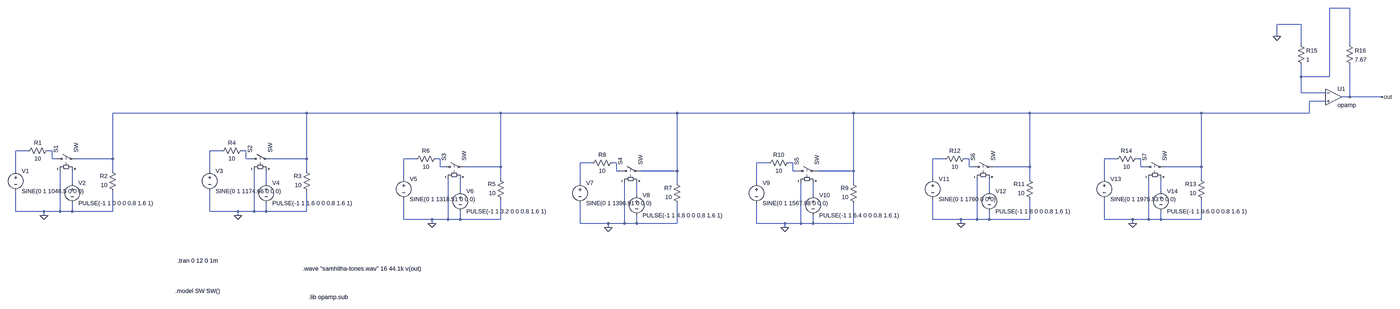
[diagram p0: schematic tones.asc, whole sheet]
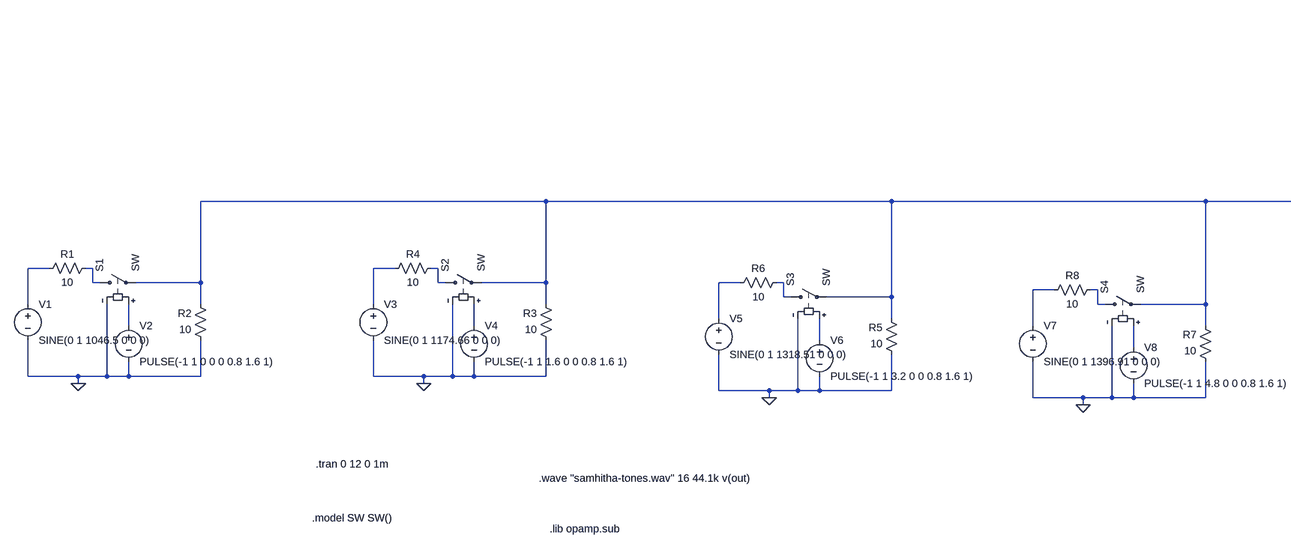
[diagram p1: schematic tones.asc, part, row 1 of 1, column 1 of 2]
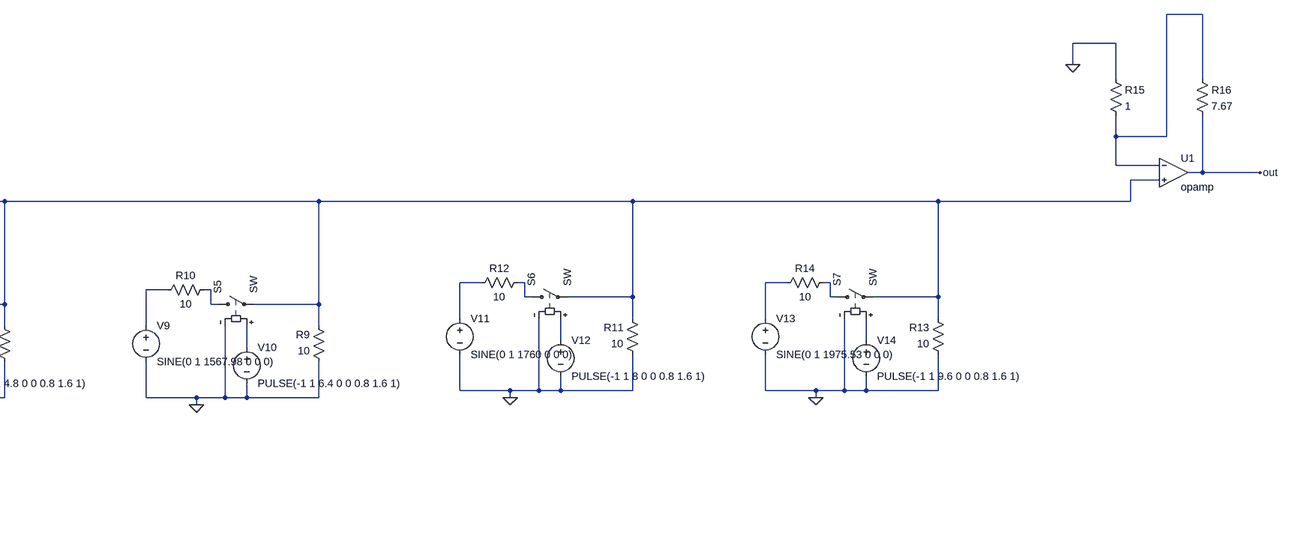
[diagram p2: schematic tones.asc, part, row 1 of 1, column 2 of 2]
tones.asc, the LTspice schematic file:
Version 4
SHEET 1 4744 1940
WIRE 4528 -1920 4448 -1920
WIRE 4336 -1856 4240 -1856
WIRE 4240 -1808 4240 -1856
WIRE 4336 -1776 4336 -1856
WIRE 4528 -1776 4528 -1920
WIRE 4336 -1648 4336 -1696
WIRE 4448 -1648 4448 -1920
WIRE 4448 -1648 4336 -1648
WIRE 4336 -1584 4336 -1648
WIRE 4432 -1584 4336 -1584
WIRE 4528 -1568 4528 -1696
WIRE 4528 -1568 4496 -1568
WIRE 4656 -1568 4528 -1568
WIRE 4432 -1552 4368 -1552
WIRE 96 -1504 -672 -1504
WIRE 864 -1504 96 -1504
WIRE 1632 -1504 864 -1504
WIRE 2384 -1504 1632 -1504
WIRE 3168 -1504 2384 -1504
WIRE 3904 -1504 3168 -1504
WIRE 4368 -1504 4368 -1552
WIRE 4368 -1504 3904 -1504
WIRE -1008 -1232 -1056 -1232
WIRE -912 -1232 -928 -1232
WIRE -240 -1232 -288 -1232
WIRE -144 -1232 -160 -1232
WIRE -912 -1200 -912 -1232
WIRE -896 -1200 -912 -1200
WIRE -672 -1200 -672 -1504
WIRE -672 -1200 -816 -1200
WIRE -144 -1200 -144 -1232
WIRE -128 -1200 -144 -1200
WIRE 96 -1200 96 -1504
WIRE 96 -1200 -48 -1200
WIRE 528 -1200 480 -1200
WIRE 624 -1200 608 -1200
WIRE 2832 -1200 2784 -1200
WIRE 2928 -1200 2912 -1200
WIRE 3568 -1200 3520 -1200
WIRE 3664 -1200 3648 -1200
WIRE 1296 -1184 1248 -1184
WIRE 1392 -1184 1376 -1184
WIRE 2048 -1184 2000 -1184
WIRE 2144 -1184 2128 -1184
WIRE 624 -1168 624 -1200
WIRE 640 -1168 624 -1168
WIRE 864 -1168 864 -1504
WIRE 864 -1168 720 -1168
WIRE 2928 -1168 2928 -1200
WIRE 2944 -1168 2928 -1168
WIRE 3168 -1168 3168 -1504
WIRE 3168 -1168 3024 -1168
WIRE 3664 -1168 3664 -1200
WIRE 3680 -1168 3664 -1168
WIRE 3904 -1168 3904 -1504
WIRE 3904 -1168 3760 -1168
WIRE -1056 -1152 -1056 -1232
WIRE -672 -1152 -672 -1200
WIRE -288 -1152 -288 -1232
WIRE 96 -1152 96 -1200
WIRE 1392 -1152 1392 -1184
WIRE 1408 -1152 1392 -1152
WIRE 1632 -1152 1632 -1504
WIRE 1632 -1152 1488 -1152
WIRE 2144 -1152 2144 -1184
WIRE 2160 -1152 2144 -1152
WIRE 2384 -1152 2384 -1504
WIRE 2384 -1152 2240 -1152
WIRE 480 -1120 480 -1200
WIRE 864 -1120 864 -1168
WIRE 2784 -1120 2784 -1200
WIRE 3168 -1120 3168 -1168
WIRE 3520 -1120 3520 -1200
WIRE 3904 -1120 3904 -1168
WIRE -832 -1104 -832 -1152
WIRE -64 -1104 -64 -1152
WIRE 1248 -1104 1248 -1184
WIRE 1632 -1104 1632 -1152
WIRE 2000 -1104 2000 -1184
WIRE 2384 -1104 2384 -1152
WIRE 704 -1072 704 -1120
WIRE 3008 -1072 3008 -1120
WIRE 3744 -1072 3744 -1120
WIRE 1472 -1056 1472 -1104
WIRE 2224 -1056 2224 -1104
WIRE -1056 -992 -1056 -1072
WIRE -944 -992 -1056 -992
WIRE -880 -992 -880 -1152
WIRE -880 -992 -944 -992
WIRE -832 -992 -832 -1024
WIRE -832 -992 -880 -992
WIRE -672 -992 -672 -1072
WIRE -672 -992 -832 -992
WIRE -288 -992 -288 -1072
WIRE -176 -992 -288 -992
WIRE -112 -992 -112 -1152
WIRE -112 -992 -176 -992
WIRE -64 -992 -64 -1024
WIRE -64 -992 -112 -992
WIRE 96 -992 96 -1072
WIRE 96 -992 -64 -992
WIRE -944 -976 -944 -992
WIRE -176 -976 -176 -992
WIRE 480 -960 480 -1040
WIRE 592 -960 480 -960
WIRE 656 -960 656 -1120
WIRE 656 -960 592 -960
WIRE 704 -960 704 -992
WIRE 704 -960 656 -960
WIRE 864 -960 864 -1040
WIRE 864 -960 704 -960
WIRE 2784 -960 2784 -1040
WIRE 2896 -960 2784 -960
WIRE 2960 -960 2960 -1120
WIRE 2960 -960 2896 -960
WIRE 3008 -960 3008 -992
WIRE 3008 -960 2960 -960
WIRE 3168 -960 3168 -1040
WIRE 3168 -960 3008 -960
WIRE 3520 -960 3520 -1040
WIRE 3632 -960 3520 -960
WIRE 3696 -960 3696 -1120
WIRE 3696 -960 3632 -960
WIRE 3744 -960 3744 -992
WIRE 3744 -960 3696 -960
WIRE 3904 -960 3904 -1040
WIRE 3904 -960 3744 -960
WIRE 592 -944 592 -960
WIRE 1248 -944 1248 -1024
WIRE 1360 -944 1248 -944
WIRE 1424 -944 1424 -1104
WIRE 1424 -944 1360 -944
WIRE 1472 -944 1472 -976
WIRE 1472 -944 1424 -944
WIRE 1632 -944 1632 -1024
WIRE 1632 -944 1472 -944
WIRE 2000 -944 2000 -1024
WIRE 2112 -944 2000 -944
WIRE 2176 -944 2176 -1104
WIRE 2176 -944 2112 -944
WIRE 2224 -944 2224 -976
WIRE 2224 -944 2176 -944
WIRE 2384 -944 2384 -1024
WIRE 2384 -944 2224 -944
WIRE 2896 -944 2896 -960
WIRE 3632 -944 3632 -960
WIRE 1360 -928 1360 -944
WIRE 2112 -928 2112 -944
FLAG -944 -976 0
FLAG -176 -976 0
FLAG 592 -944 0
FLAG 1360 -928 0
FLAG 2112 -928 0
FLAG 2896 -944 0
FLAG 3632 -944 0
FLAG 4240 -1808 0
FLAG 4656 -1568 out
SYMBOL voltage -1056 -1168 R0
WINDOW 123 0 0 Left 0
WINDOW 39 0 0 Left 0
SYMATTR InstName V1
SYMATTR Value SINE(0 1 1046.5 0 0 0)
SYMBOL sw -912 -1200 R270
SYMATTR InstName S1
SYMBOL voltage -832 -1120 R0
WINDOW 123 0 0 Left 0
WINDOW 39 0 0 Left 0
SYMATTR InstName V2
SYMATTR Value PULSE(-1 1 0 0 0 0.8 1.6 1)
SYMBOL res -656 -1056 R180
WINDOW 0 36 76 Left 2
WINDOW 3 36 40 Left 2
SYMATTR InstName R2
SYMATTR Value 10
SYMBOL res -912 -1248 R90
WINDOW 0 0 56 VBottom 2
WINDOW 3 32 56 VTop 2
SYMATTR InstName R1
SYMATTR Value 10
SYMBOL voltage -288 -1168 R0
WINDOW 123 0 0 Left 0
WINDOW 39 0 0 Left 0
SYMATTR InstName V3
SYMATTR Value SINE(0 1 1174.66 0 0 0)
SYMBOL sw -144 -1200 R270
SYMATTR InstName S2
SYMBOL voltage -64 -1120 R0
WINDOW 123 0 0 Left 0
WINDOW 39 0 0 Left 0
SYMATTR InstName V4
SYMATTR Value PULSE(-1 1 1.6 0 0 0.8 1.6 1)
SYMBOL res 112 -1056 R180
WINDOW 0 36 76 Left 2
WINDOW 3 36 40 Left 2
SYMATTR InstName R3
SYMATTR Value 10
SYMBOL res -144 -1248 R90
WINDOW 0 0 56 VBottom 2
WINDOW 3 32 56 VTop 2
SYMATTR InstName R4
SYMATTR Value 10
SYMBOL voltage 480 -1136 R0
WINDOW 123 0 0 Left 0
WINDOW 39 0 0 Left 0
SYMATTR InstName V5
SYMATTR Value SINE(0 1 1318.51 0 0 0)
SYMBOL sw 624 -1168 R270
SYMATTR InstName S3
SYMBOL voltage 704 -1088 R0
WINDOW 123 0 0 Left 0
WINDOW 39 0 0 Left 0
SYMATTR InstName V6
SYMATTR Value PULSE(-1 1 3.2 0 0 0.8 1.6 1)
SYMBOL res 880 -1024 R180
WINDOW 0 36 76 Left 2
WINDOW 3 36 40 Left 2
SYMATTR InstName R5
SYMATTR Value 10
SYMBOL res 624 -1216 R90
WINDOW 0 0 56 VBottom 2
WINDOW 3 32 56 VTop 2
SYMATTR InstName R6
SYMATTR Value 10
SYMBOL voltage 1248 -1120 R0
WINDOW 123 0 0 Left 0
WINDOW 39 0 0 Left 0
SYMATTR InstName V7
SYMATTR Value SINE(0 1 1396.91 0 0 0)
SYMBOL sw 1392 -1152 R270
SYMATTR InstName S4
SYMBOL voltage 1472 -1072 R0
WINDOW 123 0 0 Left 0
WINDOW 39 0 0 Left 0
SYMATTR InstName V8
SYMATTR Value PULSE(-1 1 4.8 0 0 0.8 1.6 1)
SYMBOL res 1648 -1008 R180
WINDOW 0 36 76 Left 2
WINDOW 3 36 40 Left 2
SYMATTR InstName R7
SYMATTR Value 10
SYMBOL res 1392 -1200 R90
WINDOW 0 0 56 VBottom 2
WINDOW 3 32 56 VTop 2
SYMATTR InstName R8
SYMATTR Value 10
SYMBOL voltage 2000 -1120 R0
WINDOW 123 0 0 Left 0
WINDOW 39 0 0 Left 0
SYMATTR InstName V9
SYMATTR Value SINE(0 1 1567.98 0 0 0)
SYMBOL sw 2144 -1152 R270
SYMATTR InstName S5
SYMBOL voltage 2224 -1072 R0
WINDOW 123 0 0 Left 0
WINDOW 39 0 0 Left 0
SYMATTR InstName V10
SYMATTR Value PULSE(-1 1 6.4 0 0 0.8 1.6 1)
SYMBOL res 2400 -1008 R180
WINDOW 0 36 76 Left 2
WINDOW 3 36 40 Left 2
SYMATTR InstName R9
SYMATTR Value 10
SYMBOL res 2144 -1200 R90
WINDOW 0 0 56 VBottom 2
WINDOW 3 32 56 VTop 2
SYMATTR InstName R10
SYMATTR Value 10
SYMBOL voltage 2784 -1136 R0
WINDOW 123 0 0 Left 0
WINDOW 39 0 0 Left 0
SYMATTR InstName V11
SYMATTR Value SINE(0 1 1760 0 0 0)
SYMBOL sw 2928 -1168 R270
SYMATTR InstName S6
SYMBOL voltage 3008 -1088 R0
WINDOW 123 0 0 Left 0
WINDOW 39 0 0 Left 0
SYMATTR InstName V12
SYMATTR Value PULSE(-1 1 8 0 0 0.8 1.6 1)
SYMBOL res 3184 -1024 R180
WINDOW 0 36 76 Left 2
WINDOW 3 36 40 Left 2
SYMATTR InstName R11
SYMATTR Value 10
SYMBOL res 2928 -1216 R90
WINDOW 0 0 56 VBottom 2
WINDOW 3 32 56 VTop 2
SYMATTR InstName R12
SYMATTR Value 10
SYMBOL voltage 3520 -1136 R0
WINDOW 123 0 0 Left 0
WINDOW 39 0 0 Left 0
SYMATTR InstName V13
SYMATTR Value SINE(0 1 1975.53 0 0 0)
SYMBOL sw 3664 -1168 R270
SYMATTR InstName S7
SYMBOL voltage 3744 -1088 R0
WINDOW 123 0 0 Left 0
WINDOW 39 0 0 Left 0
SYMATTR InstName V14
SYMATTR Value PULSE(-1 1 9.6 0 0 0.8 1.6 1)
SYMBOL res 3920 -1024 R180
WINDOW 0 36 76 Left 2
WINDOW 3 36 40 Left 2
SYMATTR InstName R13
SYMATTR Value 10
SYMBOL res 3664 -1216 R90
WINDOW 0 0 56 VBottom 2
WINDOW 3 32 56 VTop 2
SYMATTR InstName R14
SYMATTR Value 10
SYMBOL OpAmps\\opamp 4464 -1632 R0
SYMATTR InstName U1
SYMBOL res 4320 -1792 R0
SYMATTR InstName R15
SYMATTR Value 1
SYMBOL res 4512 -1792 R0
SYMATTR InstName R16
SYMATTR Value 7.67
TEXT -424 -560 Left 2 !.model SW SW()
TEXT -416 -680 Left 2 !.tran 0 12 0 1m
TEXT 80 -648 Left 2 !.wave "samhitha-tones.wav" 16 44.1k v(out)
TEXT 104 -536 Left 2 !.lib opamp.sub

The netlist it stands for:
* tones.asc
V1 N003 0 SINE(0 1 1046.5 0 0 0)
S1 N004 N002 N017 0 SW
V2 N017 0 PULSE(-1 1 0 0 0 0.8 1.6 1)
R2 0 N002 10
R1 N004 N003 10
V3 N005 0 SINE(0 1 1174.66 0 0 0)
S2 N006 N002 N018 0 SW
V4 N018 0 PULSE(-1 1 1.6 0 0 0.8 1.6 1)
R3 0 N002 10
R4 N006 N005 10
V5 N007 0 SINE(0 1 1318.51 0 0 0)
S3 N008 N002 N019 0 SW
V6 N019 0 PULSE(-1 1 3.2 0 0 0.8 1.6 1)
R5 0 N002 10
R6 N008 N007 10
V7 N013 0 SINE(0 1 1396.91 0 0 0)
S4 N014 N002 N022 0 SW
V8 N022 0 PULSE(-1 1 4.8 0 0 0.8 1.6 1)
R7 0 N002 10
R8 N014 N013 10
V9 N015 0 SINE(0 1 1567.98 0 0 0)
S5 N016 N002 N023 0 SW
V10 N023 0 PULSE(-1 1 6.4 0 0 0.8 1.6 1)
R9 0 N002 10
R10 N016 N015 10
V11 N009 0 SINE(0 1 1760 0 0 0)
S6 N010 N002 N020 0 SW
V12 N020 0 PULSE(-1 1 8 0 0 0.8 1.6 1)
R11 0 N002 10
R12 N010 N009 10
V13 N011 0 SINE(0 1 1975.53 0 0 0)
S7 N012 N002 N021 0 SW
V14 N021 0 PULSE(-1 1 9.6 0 0 0.8 1.6 1)
R13 0 N002 10
R14 N012 N011 10
XU1 N001 N002 out opamp Aol=100K GBW=10Meg  ; pins invin noninvin out
R15 0 N001 1
R16 N001 out 7.67
.model SW SW()
.tran 0 12 0 1m
.wave "samhitha-tones.wav" 16 44.1k v(out)
.lib opamp.sub
.backanno
.end